# Altium project STM32F373BluePill.PrjPcb (part 2 of 4)
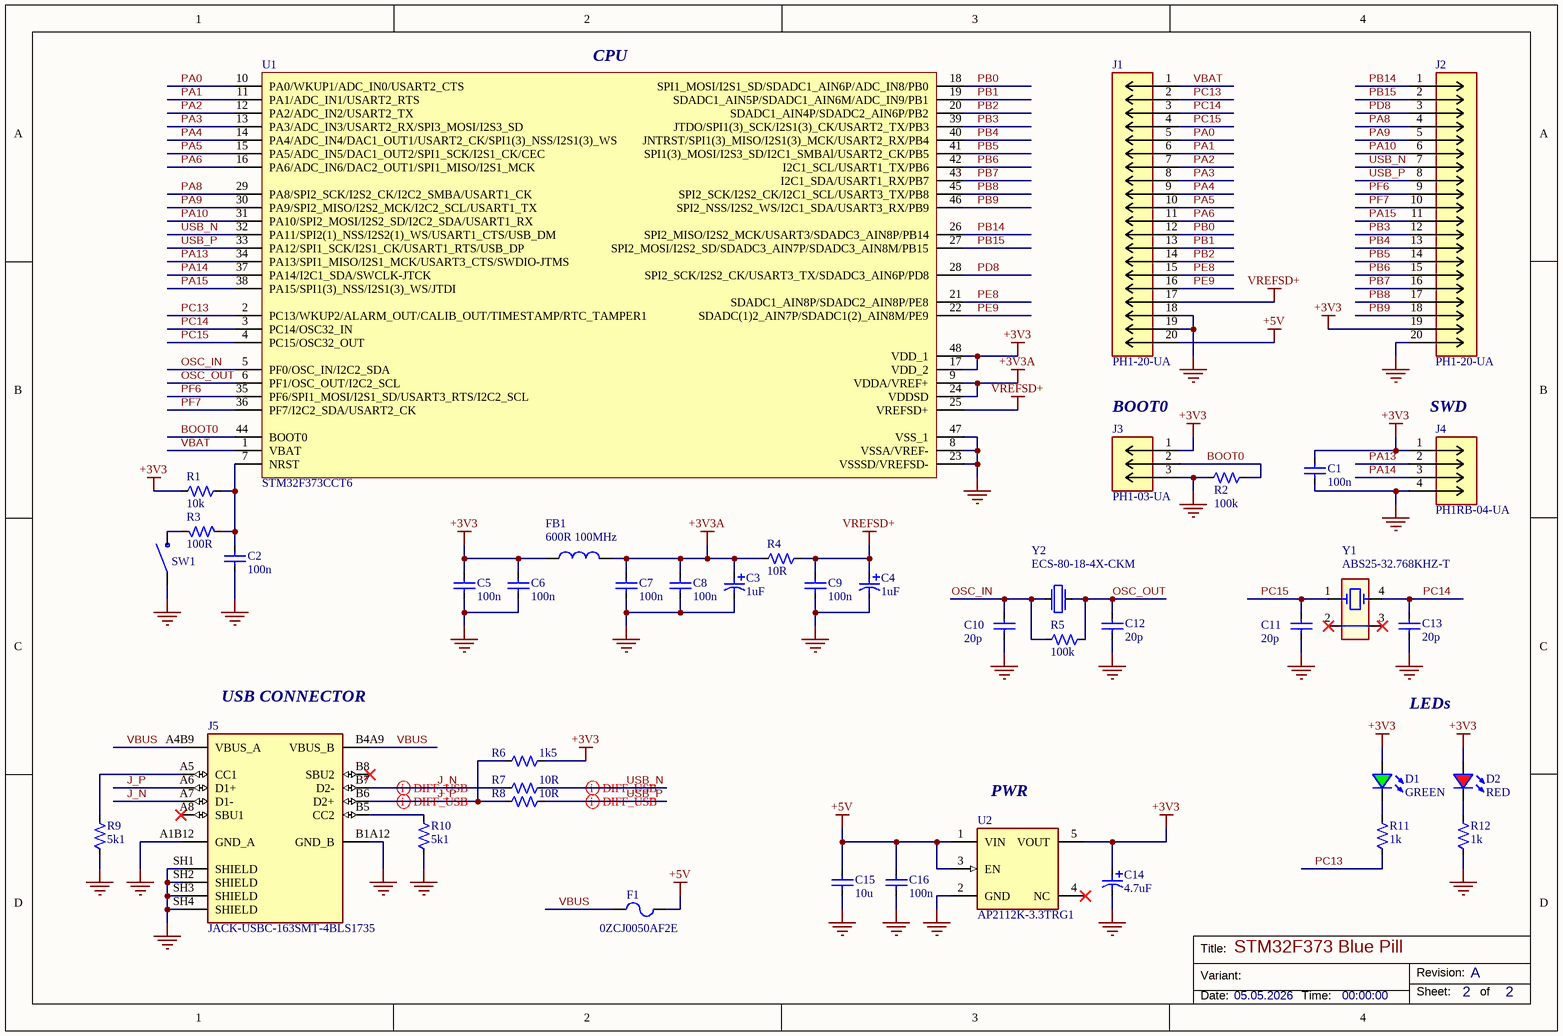
[diagram p2: [02]-STM32F373BluePill.SchDoc]

## Sheet [02]-STM32F373BluePill.SchDoc (continued)
### Library data of the parts
C1 C2 C5-C9 C16 = CAPC_GCM188R71H104KA57J: 0.1 µF ±10% 50V Ceramic Capacitor X7R 0603 (1608 Metric); Manufacturer 1: Murata; Manufacturer Lifecycle Status: NRND; Capacitance: 100nF; Tolerance: 10%; Case/Package: 0603; Supplier 1: DigiKey; Manufacturer Part Number 1: GCM188R71H104KA57J; Stock 1: 7240958; Pricing 1: 1=0.19, 10=0.109, 50=0.0774, 100=0.0678, 500=0.05152, 1000=0.0465, 2500=0.04122, 5000=0.03804 (USD); RoHS: Compliant; Case Code (Imperial): 0603; Case Code (Metric): 1608; Country of Origin: Philippines; Depth: 800µm; Dielectric: X7R; Dielectric Material: Ceramic; Export Control Classification Number (ECCN) Code: EAR99; Height: 800µm; Harmonized Tariff Schedule (HTS) Code: 8532.24.00.20; Introduction Date: 2007-06-21; Lead Free: Lead Free; Length: 1.6mm; Lifecycle Status: NRND; Material: Ceramic; Max Operating Temperature: 125°C; Min Operating Temperature: -55°C; Mount: Surface Mount; Number of Terminals: 2; Packaging: Cut Tape; Radiation Hardening: No; Ratings: AEC-Q200; REACH SVHC: Yes; Schedule B: 8532240020, 8532240020|8532240020, 8532240020|8532240020|8532240020, 8532240020|8532240020|8532240020|8532240020; Termination: SMD/SMT; Voltage Rating: 50V; Voltage Rating (DC): 50V; Width: 800µm; ComponentLink1URL: https://datasheet.octopart.com:443/GCM188R71H104KA57J-Murata-datasheet-68587539.pdf?src-supplier=Newark; ComponentLink1Description: https://datasheet.octopart.com:443/GCM188R71H104KA57J-Murata-datasheet-68587539.pdf?src-supplier=Newark; ComponentLink2URL: https://datasheet.octopart.com:443/GCM188R71H104KA57J-Murata-datasheet-141267633.pdf?src-supplier=Geoflip; ComponentLink2Description: https://datasheet.octopart.com:443/GCM188R71H104KA57J-Murata-datasheet-141267633.pdf?src-supplier=Geoflip; ComponentLink3URL: https://datasheet.octopart.com:443/GCM188R71H104KA57J-Murata-datasheet-140658746.pdf?src-supplier=Ciiva; ComponentLink3Description: https://datasheet.octopart.com:443/GCM188R71H104KA57J-Murata-datasheet-140658746.pdf?src-supplier=Ciiva; ComponentLink4URL: https://datasheet.octopart.com:443/GCM188R71H104KA57J-Murata-datasheet-138718311.pdf?src-supplier=Ciiva; ComponentLink4Description: https://datasheet.octopart.com:443/GCM188R71H104KA57J-Murata-datasheet-138718311.pdf?src-supplier=Ciiva; ComponentLink5URL: https://datasheet.octopart.com:443/GCM188R71H104KA57J-Murata-datasheet-62117434.pdf?src-supplier=TME; ComponentLink5Description: https://datasheet.octopart.com:443/GCM188R71H104KA57J-Murata-datasheet-62117434.pdf?src-supplier=TME; ComponentLink6URL: https://datasheet.octopart.com/GCM188R71H104KA57J-Murata-datasheet-12557478.pdf; ComponentLink6Description: https://datasheet.octopart.com/GCM188R71H104KA57J-Murata-datasheet-12557478.pdf; ComponentLink7URL: https://datasheet.octopart.com:443/GCM188R71H104KA57J-Murata-datasheet-44104515.pdf?src-supplier=Future+Electronics; ComponentLink7Description: https://datasheet.octopart.com:443/GCM188R71H104KA57J-Murata-datasheet-44104515.pdf?src-supplier=Future+Electronics; ComponentLink8URL: http://sigma.octopart.com:80/reach_statement/Murata-company-16.pdf?src-supplier=Compliance+Statements; ComponentLink8Description: http://sigma.octopart.com:80/reach_statement/Murata-company-16.pdf?src-supplier=Compliance+Statements; Supplier Part Number 1: 490-8020-1-ND
C3 C4 = CAP_T491A105K020AT: 1 µF Molded Tantalum Capacitors 20 V 1206 (3216 Metric) 9Ohm; Manufacturer 1: Yageo Group; Capacitance: 1µF; Dissipation Factor: 4%; ESR (Equivalent Series Resistance): 9Ω; Leakage Current: 500nA; Life (Hours): 2000hours; Polarity: Polar; Ripple Current: 36mA; Tolerance: 10%; Voltage: 20V; Supplier 1: DigiKey; Manufacturer Part Number 1: T491A105K020AT; Stock 1: 46509; Pricing 1: 1=0.37, 10=0.218, 50=0.1602, 100=0.1424, 500=0.11252, 1000=0.1033 (USD); RoHS: Compliant; Case Code (Imperial): 1206; Case Code (Metric): 3216; China RoHS: Compliant; Country of Origin: Mexico; Depth: 1.6mm; Dielectric Material: Tantalum; Export Control Classification Number (ECCN) Code: EAR99; Features: General Purpose; Height: 1.6mm; Height - Seated (Max): 1.8034mm; Harmonized Tariff Schedule (HTS) Code: 8532.21.00.50; Introduction Date: 2001-10-01; Lead Free: Lead Free; Lead Pitch: 1.2mm; Length: 3.2mm; Lifecycle Status: Production; Max Operating Temperature: 125°C; Min Operating Temperature: -55°C; Mount: Surface Mount; Number of Pins: 2; Number of Terminals: 2; Packaging: Cut Tape; Radiation Hardening: No; REACH SVHC: Yes; Schedule B: 8532210050, 8532210050|8532210050|8532210050|8532210050|8532210050; Termination: SMD/SMT; Voltage Rating: 20V; Voltage Rating (DC): 20V; Width: 1.6mm; ComponentLink1URL: https://datasheet.octopart.com:443/T491A105K020AT-KEMET-datasheet-182059868.pdf?src-supplier=IHS; ComponentLink1Description: https://datasheet.octopart.com:443/T491A105K020AT-KEMET-datasheet-182059868.pdf?src-supplier=IHS; ComponentLink2URL: https://datasheet.octopart.com:443/T491A105K020AT-KEMET-datasheet-136608597.pdf?src-supplier=Newark; ComponentLink2Description: https://datasheet.octopart.com:443/T491A105K020AT-KEMET-datasheet-136608597.pdf?src-supplier=Newark; ComponentLink3URL: https://datasheet.octopart.com:443/T491A105K020AT-KEMET-datasheet-84169765.pdf?src-supplier=Newark; ComponentLink3Description: https://datasheet.octopart.com:443/T491A105K020AT-KEMET-datasheet-84169765.pdf?src-supplier=Newark; ComponentLink4URL: https://datasheet.octopart.com:443/T491A105K020AT-Kemet-datasheet-26590412.pdf?src-supplier=Newark; ComponentLink4Description: https://datasheet.octopart.com:443/T491A105K020AT-Kemet-datasheet-26590412.pdf?src-supplier=Newark; ComponentLink5URL: https://datasheet.octopart.com:443/T491A105K020AT-Kemet-datasheet-21202602.pdf?src-supplier=Newark; ComponentLink5Description: https://datasheet.octopart.com:443/T491A105K020AT-Kemet-datasheet-21202602.pdf?src-supplier=Newark; ComponentLink6URL: https://datasheet.octopart.com:443/T491A105K020AT-KEMET-datasheet-181972716.pdf?src-supplier=Farnell; ComponentLink6Description: https://datasheet.octopart.com:443/T491A105K020AT-KEMET-datasheet-181972716.pdf?src-supplier=Farnell; ComponentLink7URL: https://datasheet.octopart.com:443/T491A105K020AT-KEMET-datasheet-101578314.pdf?src-supplier=Farnell; ComponentLink7Description: https://datasheet.octopart.com:443/T491A105K020AT-KEMET-datasheet-101578314.pdf?src-supplier=Farnell; ComponentLink8URL: https://datasheet.octopart.com:443/T491A105K020AT-Kemet-datasheet-32026213.pdf?src-supplier=Farnell; ComponentLink8Description: https://datasheet.octopart.com:443/T491A105K020AT-Kemet-datasheet-32026213.pdf?src-supplier=Farnell; ComponentLink9URL: https://datasheet.octopart.com:443/T491A105K020AT-KEMET-datasheet-176142724.pdf?src-supplier=Farnell; ComponentLink9Description: https://datasheet.octopart.com:443/T491A105K020AT-KEMET-datasheet-176142724.pdf?src-supplier=Farnell; ComponentLink10URL: https://datasheet.octopart.com:443/T491A105K020AT.-Kemet-datasheet-32543724.pdf?src-supplier=Farnell; ComponentLink10Description: https://datasheet.octopart.com:443/T491A105K020AT.-Kemet-datasheet-32543724.pdf?src-supplier=Farnell; ComponentLink11URL: https://datasheet.octopart.com:443/T491A105K020AT-Kemet-datasheet-10403912.pdf?src-supplier=Farnell; ComponentLink11Description: https://datasheet.octopart.com:443/T491A105K020AT-Kemet-datasheet-10403912.pdf?src-supplier=Farnell; ComponentLink12URL: https://datasheet.octopart.com:443/T491A105K020AT-Kemet-datasheet-7833651.pdf?src-supplier=Farnell; ComponentLink12Description: https://datasheet.octopart.com:443/T491A105K020AT-Kemet-datasheet-7833651.pdf?src-supplier=Farnell; ComponentLink13URL: https://datasheet.octopart.com:443/T491A105K020AT-Kemet-datasheet-7601896.pdf?src-supplier=Farnell; ComponentLink13Description: https://datasheet.octopart.com:443/T491A105K020AT-Kemet-datasheet-7601896.pdf?src-supplier=Farnell; ComponentLink14URL: https://datasheet.octopart.com:443/T491A105K020AT-Kemet-datasheet-5316294.pdf?src-supplier=Farnell; ComponentLink14Description: https://datasheet.octopart.com:443/T491A105K020AT-Kemet-datasheet-5316294.pdf?src-supplier=Farnell; ComponentLink15URL: https://datasheet.octopart.com:443/T491A105K020AT-Kemet-datasheet-8092359.pdf?src-supplier=Farnell; ComponentLink15Description: https://datasheet.octopart.com:443/T491A105K020AT-Kemet-datasheet-8092359.pdf?src-supplier=Farnell; ComponentLink16URL: https://datasheet.octopart.com:443/T491A105K020AT-Kemet-datasheet-5313890.pdf?src-supplier=Farnell; ComponentLink16Description: https://datasheet.octopart.com:443/T491A105K020AT-Kemet-datasheet-5313890.pdf?src-supplier=Farnell; ComponentLink17URL: https://datasheet.octopart.com:443/T491A105K020AT-Kemet-datasheet-5314449.pdf?src-supplier=Farnell; ComponentLink17Description: https://datasheet.octopart.com:443/T491A105K020AT-Kemet-datasheet-5314449.pdf?src-supplier=Farnell; ComponentLink18URL: https://datasheet.octopart.com:443/T491A105K020AT-Kemet-datasheet-5390537.pdf?src-supplier=Farnell; ComponentLink18Description: https://datasheet.octopart.com:443/T491A105K020AT-Kemet-datasheet-5390537.pdf?src-supplier=Farnell; ComponentLink19URL: https://datasheet.octopart.com:443/T491A105K020AT-Kemet-datasheet-5314969.pdf?src-supplier=Farnell; ComponentLink19Description: https://datasheet.octopart.com:443/T491A105K020AT-Kemet-datasheet-5314969.pdf?src-supplier=Farnell; ComponentLink20URL: https://datasheet.octopart.com:443/T491A105K020AT-Kemet-datasheet-5314627.pdf?src-supplier=Farnell; ComponentLink20Description: https://datasheet.octopart.com:443/T491A105K020AT-Kemet-datasheet-5314627.pdf?src-supplier=Farnell; ComponentLink21URL: https://datasheet.octopart.com:443/T491A105K020AT-Kemet-datasheet-5389132.pdf?src-supplier=Farnell; ComponentLink21Description: https://datasheet.octopart.com:443/T491A105K020AT-Kemet-datasheet-5389132.pdf?src-supplier=Farnell; ComponentLink22URL: https://datasheet.octopart.com:443/T491A105K020AT-Kemet-datasheet-5313836.pdf?src-supplier=Farnell; ComponentLink22Description: https://datasheet.octopart.com:443/T491A105K020AT-Kemet-datasheet-5313836.pdf?src-supplier=Farnell; ComponentLink23URL: https://datasheet.octopart.com:443/T491A105K020AT-Kemet-datasheet-8111010.pdf?src-supplier=Farnell; ComponentLink23Description: https://datasheet.octopart.com:443/T491A105K020AT-Kemet-datasheet-8111010.pdf?src-supplier=Farnell; ComponentLink24URL: https://datasheet.octopart.com:443/T491A105K020AT-Kemet-datasheet-7541751.pdf?src-supplier=Farnell; ComponentLink24Description: https://datasheet.octopart.com:443/T491A105K020AT-Kemet-datasheet-7541751.pdf?src-supplier=Farnell; ComponentLink25URL: https://datasheet.octopart.com:443/T491A105K020AT-Kemet-datasheet-7627733.pdf?src-supplier=Farnell; ComponentLink25Description: https://datasheet.octopart.com:443/T491A105K020AT-Kemet-datasheet-7627733.pdf?src-supplier=Farnell; ComponentLink26URL: https://datasheet.octopart.com:443/T491A105K020AT-Kemet-datasheet-5303455.pdf?src-supplier=Farnell; ComponentLink26Description: https://datasheet.octopart.com:443/T491A105K020AT-Kemet-datasheet-5303455.pdf?src-supplier=Farnell; ComponentLink27URL: https://datasheet.octopart.com:443/T491A105K020AT-Kemet-datasheet-5315946.pdf?src-supplier=Farnell; ComponentLink27Description: https://datasheet.octopart.com:443/T491A105K020AT-Kemet-datasheet-5315946.pdf?src-supplier=Farnell; ComponentLink28URL: https://datasheet.octopart.com:443/T491A105K020AT-Kemet-datasheet-10694886.pdf?src-supplier=Farnell; ComponentLink28Description: https://datasheet.octopart.com:443/T491A105K020AT-Kemet-datasheet-10694886.pdf?src-supplier=Farnell; ComponentLink29URL: https://datasheet.octopart.com:443/T491A105K020AT-KEMET-datasheet-38887703.pdf?src-supplier=Electro+Sonic; ComponentLink29Description: https://datasheet.octopart.com:443/T491A105K020AT-KEMET-datasheet-38887703.pdf?src-supplier=Electro+Sonic; ComponentLink30URL: https://datasheet.octopart.com:443/T491A105K020AT-Kemet-datasheet-10674785.pdf?src-supplier=element14; ComponentLink30Description: https://datasheet.octopart.com:443/T491A105K020AT-Kemet-datasheet-10674785.pdf?src-supplier=element14; ComponentLink31URL: https://datasheet.octopart.com:443/T491A105K020AT-Kemet-datasheet-9885770.pdf?src-supplier=element14; ComponentLink31Description: https://datasheet.octopart.com:443/T491A105K020AT-Kemet-datasheet-9885770.pdf?src-supplier=element14; ComponentLink32URL: https://datasheet.octopart.com:443/T491A105K020AT-Kemet-datasheet-8859524.pdf?src-supplier=element14; ComponentLink32Description: https://datasheet.octopart.com:443/T491A105K020AT-Kemet-datasheet-8859524.pdf?src-supplier=element14; ComponentLink33URL: https://datasheet.octopart.com:443/T491A105K020AT-Kemet-datasheet-5314837.pdf?src-supplier=element14; ComponentLink33Description: https://datasheet.octopart.com:443/T491A105K020AT-Kemet-datasheet-5314837.pdf?src-supplier=element14; ComponentLink34URL: https://datasheet.octopart.com:443/T491A105K020AT-Kemet-datasheet-8838294.pdf?src-supplier=element14; ComponentLink34Description: https://datasheet.octopart.com:443/T491A105K020AT-Kemet-datasheet-8838294.pdf?src-supplier=element14; ComponentLink35URL: https://datasheet.octopart.com:443/T491A105K020AT-Kemet-datasheet-11547191.pdf?src-supplier=_legacy+Avnet; ComponentLink35Description: https://datasheet.octopart.com:443/T491A105K020AT-Kemet-datasheet-11547191.pdf?src-supplier=_legacy+Avnet; ComponentLink36URL: https://datasheet.octopart.com:443/T491A105K020AT-KEMET-datasheet-142660448.pdf?src-supplier=TME; ComponentLink36Description: https://datasheet.octopart.com:443/T491A105K020AT-KEMET-datasheet-142660448.pdf?src-supplier=TME; ComponentLink37URL: https://datasheet.octopart.com:443/T491A105K020AT-Kemet-datasheet-67498737.pdf?src-supplier=TME; ComponentLink37Description: https://datasheet.octopart.com:443/T491A105K020AT-Kemet-datasheet-67498737.pdf?src-supplier=TME; ComponentLink38URL: https://datasheet.octopart.com:443/T491A105K020AT-KEMET-datasheet-117635134.pdf?src-supplier=TME; ComponentLink38Description: https://datasheet.octopart.com:443/T491A105K020AT-KEMET-datasheet-117635134.pdf?src-supplier=TME; ComponentLink39URL: https://datasheet.octopart.com:443/T491A105K020AT-Kemet-datasheet-62346238.pdf?src-supplier=TME; ComponentLink39Description: https://datasheet.octopart.com:443/T491A105K020AT-Kemet-datasheet-62346238.pdf?src-supplier=TME; ComponentLink40URL: https://datasheet.octopart.com:443/T491A105K020AT-Kemet-datasheet-49872651.pdf?src-supplier=TME; ComponentLink40Description: https://datasheet.octopart.com:443/T491A105K020AT-Kemet-datasheet-49872651.pdf?src-supplier=TME; ComponentLink41URL: https://datasheet.octopart.com:443/T491A105K020AT-Kemet-datasheet-21389585.pdf?src-supplier=element14+APAC; ComponentLink41Description: https://datasheet.octopart.com:443/T491A105K020AT-Kemet-datasheet-21389585.pdf?src-supplier=element14+APAC; ComponentLink42URL: https://datasheet.octopart.com:443/T491A105K020AT-Kemet-datasheet-15068589.pdf?src-supplier=element14+APAC; ComponentLink42Description: https://datasheet.octopart.com:443/T491A105K020AT-Kemet-datasheet-15068589.pdf?src-supplier=element14+APAC; ComponentLink43URL: https://datasheet.octopart.com:443/T491A105K020AT-Kemet-datasheet-13378218.pdf?src-supplier=element14+APAC; ComponentLink43Description: https://datasheet.octopart.com:443/T491A105K020AT-Kemet-datasheet-13378218.pdf?src-supplier=element14+APAC; ComponentLink44URL: https://datasheet.octopart.com:443/T491A105K020AT-Kemet-datasheet-8189449.pdf?src-supplier=Jameco; ComponentLink44Description: https://datasheet.octopart.com:443/T491A105K020AT-Kemet-datasheet-8189449.pdf?src-supplier=Jameco; ComponentLink45URL: https://datasheet.octopart.com:443/T491A105K020AT-Kemet-datasheet-15.pdf?src-supplier=RS+(Formerly+Allied+Electronics); ComponentLink45Description: https://datasheet.octopart.com:443/T491A105K020AT-Kemet-datasheet-15.pdf?src-supplier=RS+(Formerly+Allied+Electronics); Supplier Part Number 1: 399-3679-1-ND; Case/Package: 1206
C10-C13 = CAPC_GCM1885C2A200JA16D: 20pF 100V C0G ±5% 0603 Multilayer Ceramic Capacitors MLCC - SMD/SMT ROHS; Manufacturer 1: Murata; Manufacturer Lifecycle Status: IN PRODUCTION; Temperature Coefficient: 30ppm/°C; Supplier 1: DigiKey; Manufacturer Part Number 1: GCM1885C2A200JA16D; Stock 1: 4877; Pricing 1: 1=0.1, 10=0.04, 50=0.0272, 100=0.0233, 500=0.01676, 1000=0.01475 (USD); RoHS: Compliant; Capacitance: 20pF; Case/Package: 0603; Case Code (Imperial): 0603; Case Code (Metric): 1608; Depth: 800µm; Dielectric: C0G; Dielectric Material: Ceramic; Height: 800µm; Length: 1.6mm; Lifecycle Status: Production; Material: Ceramic; Max Operating Temperature: 125°C; Min Operating Temperature: -55°C; Mount: Surface Mount; Number of Terminals: 2; Packaging: Tape & Reel; Radiation Hardening: No; Ratings: AEC-Q200; REACH SVHC: Yes; Schedule B: 8532240020, 8532240020|8532240020, 8532240020|8532240020|8532240020, 8532240020|8532240020|8532240020|8532240020; Termination: SMD/SMT; Tolerance: 5%; Voltage Rating: 100V; Voltage Rating (DC): 100V; Width: 800µm; ComponentLink1URL: https://datasheet.octopart.com:443/GCM1885C2A200JA16D-Murata-datasheet-149522631.pdf?src-supplier=Newark; ComponentLink1Description: https://datasheet.octopart.com:443/GCM1885C2A200JA16D-Murata-datasheet-149522631.pdf?src-supplier=Newark; ComponentLink2URL: https://datasheet.octopart.com:443/GCM1885C2A200JA16D-Murata-datasheet-141266620.pdf?src-supplier=Geoflip; ComponentLink2Description: https://datasheet.octopart.com:443/GCM1885C2A200JA16D-Murata-datasheet-141266620.pdf?src-supplier=Geoflip; ComponentLink3URL: https://datasheet.octopart.com:443/GCM1885C2A200JA16D-Murata-datasheet-140657476.pdf?src-supplier=Ciiva; ComponentLink3Description: https://datasheet.octopart.com:443/GCM1885C2A200JA16D-Murata-datasheet-140657476.pdf?src-supplier=Ciiva; ComponentLink4URL: https://datasheet.octopart.com:443/GCM1885C2A200JA16D-Murata-datasheet-138717120.pdf?src-supplier=Ciiva; ComponentLink4Description: https://datasheet.octopart.com:443/GCM1885C2A200JA16D-Murata-datasheet-138717120.pdf?src-supplier=Ciiva; ComponentLink5URL: https://datasheet.octopart.com:443/GCM1885C2A200JA16D-Murata-datasheet-118179445.pdf?src-supplier=Future+Electronics; ComponentLink5Description: https://datasheet.octopart.com:443/GCM1885C2A200JA16D-Murata-datasheet-118179445.pdf?src-supplier=Future+Electronics; ComponentLink6URL: https://datasheet.octopart.com:443/GCM1885C2A200JA16D-Murata-datasheet-11745854.pdf?src-supplier=Arrow+Electronics; ComponentLink6Description: https://datasheet.octopart.com:443/GCM1885C2A200JA16D-Murata-datasheet-11745854.pdf?src-supplier=Arrow+Electronics; ComponentLink7URL: https://datasheet.octopart.com:443/GCM1885C2A200JA16D-Murata-datasheet-12511495.pdf?src-supplier=TME; ComponentLink7Description: https://datasheet.octopart.com:443/GCM1885C2A200JA16D-Murata-datasheet-12511495.pdf?src-supplier=TME; ComponentLink8URL: https://datasheet.octopart.com/GCM1885C2A200JA16D-Murata-datasheet-14404810.pdf; ComponentLink8Description: https://datasheet.octopart.com/GCM1885C2A200JA16D-Murata-datasheet-14404810.pdf; ComponentLink9URL: http://sigma.octopart.com:80/reach_statement/Murata-company-16.pdf?src-supplier=Compliance+Statements; ComponentLink9Description: http://sigma.octopart.com:80/reach_statement/Murata-company-16.pdf?src-supplier=Compliance+Statements; Supplier Part Number 1: 490-11157-1-ND; Export Control Classification Number (ECCN) Code: EAR99; Harmonized Tariff Schedule (HTS) Code: 8532.24.00.20; Introduction Date: 2008-10-18
C14 = CAP_T491A475K025AT: 4.7 µF Molded Tantalum Capacitors 25 V 1206 (3216 Metric) 6Ohm; Manufacturer 1: Yageo Group; Capacitance: 4.7µF; Dissipation Factor: 8%; ESR (Equivalent Series Resistance): 6Ω; Leakage Current: 1.2µA; Life (Hours): 2000hours; Polarity: Polar; Ripple Current: 44.8mA; Tolerance: 10%; Voltage Rating: 25V; Supplier 1: DigiKey; Manufacturer Part Number 1: T491A475K025AT; Stock 1: 97298; Pricing 1: 1=0.46, 10=0.276, 50=0.2056, 100=0.1839, 500=0.14724, 1000=0.13591 (USD); RoHS: Compliant; Case/Package: 1206; Case Code (Imperial): 1206; Case Code (Metric): 3216; China RoHS: Compliant; Country of Origin: Mexico; Depth: 1.6mm; Dielectric Material: Tantalum; Export Control Classification Number (ECCN) Code: EAR99; Features: General Purpose; Height: 1.6mm; Height - Seated (Max): 1.8034mm; Harmonized Tariff Schedule (HTS) Code: 8532.21.00.50; Introduction Date: 2007-10-05; Lead Free: Lead Free; Length: 3.2mm; Lifecycle Status: Production; Max Operating Temperature: 125°C; Min Operating Temperature: -55°C; Mount: Surface Mount; Number of Pins: 2; Number of Terminals: 2; Radiation Hardening: No; REACH SVHC: Yes; Schedule B: 8532210050, 8532210050|8532210050|8532210050|8532210050|8532210050; Terminal Pitch: 800µm; Termination: SMD/SMT; Voltage Rating (DC): 25V; Weight: 16.187578mg; Width: 1.6mm; ComponentLink1URL: https://datasheet.octopart.com:443/T491A475K025AT-KEMET-datasheet-182059868.pdf?src-supplier=IHS; ComponentLink1Description: https://datasheet.octopart.com:443/T491A475K025AT-KEMET-datasheet-182059868.pdf?src-supplier=IHS; ComponentLink2URL: https://datasheet.octopart.com:443/T491A475K025AT-KEMET-datasheet-84169765.pdf?src-supplier=element14+APAC; ComponentLink2Description: https://datasheet.octopart.com:443/T491A475K025AT-KEMET-datasheet-84169765.pdf?src-supplier=element14+APAC; ComponentLink3URL: https://datasheet.octopart.com:443/T491A475K025AT-Kemet-datasheet-15068589.pdf?src-supplier=element14+APAC; ComponentLink3Description: https://datasheet.octopart.com:443/T491A475K025AT-Kemet-datasheet-15068589.pdf?src-supplier=element14+APAC; ComponentLink4URL: https://datasheet.octopart.com:443/T491A475K025AT-Kemet-datasheet-66535510.pdf?src-supplier=element14+APAC; ComponentLink4Description: https://datasheet.octopart.com:443/T491A475K025AT-Kemet-datasheet-66535510.pdf?src-supplier=element14+APAC; ComponentLink5URL: https://datasheet.octopart.com:443/T491A475K025AT-Kemet-datasheet-32543724.pdf?src-supplier=element14+APAC; ComponentLink5Description: https://datasheet.octopart.com:443/T491A475K025AT-Kemet-datasheet-32543724.pdf?src-supplier=element14+APAC; ComponentLink6URL: https://datasheet.octopart.com:443/T491A475K025AT-Kemet-datasheet-32026213.pdf?src-supplier=element14+APAC; ComponentLink6Description: https://datasheet.octopart.com:443/T491A475K025AT-Kemet-datasheet-32026213.pdf?src-supplier=element14+APAC; ComponentLink7URL: https://datasheet.octopart.com:443/T491A475K025AT-KEMET-datasheet-136608597.pdf?src-supplier=Newark; ComponentLink7Description: https://datasheet.octopart.com:443/T491A475K025AT-KEMET-datasheet-136608597.pdf?src-supplier=Newark; ComponentLink8URL: https://datasheet.octopart.com:443/T491A475K025AT-KEMET-datasheet-176142744.pdf?src-supplier=Newark; ComponentLink8Description: https://datasheet.octopart.com:443/T491A475K025AT-KEMET-datasheet-176142744.pdf?src-supplier=Newark; ComponentLink9URL: https://datasheet.octopart.com:443/T491A475K025AT-Kemet-datasheet-21202602.pdf?src-supplier=Newark; ComponentLink9Description: https://datasheet.octopart.com:443/T491A475K025AT-Kemet-datasheet-21202602.pdf?src-supplier=Newark; ComponentLink10URL: https://datasheet.octopart.com:443/T491A475K025AT-KEMET-datasheet-181972791.pdf?src-supplier=Farnell; ComponentLink10Description: https://datasheet.octopart.com:443/T491A475K025AT-KEMET-datasheet-181972791.pdf?src-supplier=Farnell; ComponentLink11URL: https://datasheet.octopart.com:443/T491A475K025AT-KEMET-datasheet-101578389.pdf?src-supplier=Farnell; ComponentLink11Description: https://datasheet.octopart.com:443/T491A475K025AT-KEMET-datasheet-101578389.pdf?src-supplier=Farnell; ComponentLink12URL: https://datasheet.octopart.com:443/T491A475K025AT-Kemet-datasheet-13378218.pdf?src-supplier=Farnell; ComponentLink12Description: https://datasheet.octopart.com:443/T491A475K025AT-Kemet-datasheet-13378218.pdf?src-supplier=Farnell; ComponentLink13URL: https://datasheet.octopart.com:443/T491A475K025AT-Kemet-datasheet-14421347.pdf?src-supplier=Farnell; ComponentLink13Description: https://datasheet.octopart.com:443/T491A475K025AT-Kemet-datasheet-14421347.pdf?src-supplier=Farnell; ComponentLink14URL: https://datasheet.octopart.com:443/T491A475K025AT-Kemet-datasheet-10694886.pdf?src-supplier=Farnell; ComponentLink14Description: https://datasheet.octopart.com:443/T491A475K025AT-Kemet-datasheet-10694886.pdf?src-supplier=Farnell; ComponentLink15URL: https://datasheet.octopart.com:443/T491A475K025AT-KEMET-datasheet-142660448.pdf?src-supplier=TME; ComponentLink15Description: https://datasheet.octopart.com:443/T491A475K025AT-KEMET-datasheet-142660448.pdf?src-supplier=TME; ComponentLink16URL: https://datasheet.octopart.com:443/T491A475K025AT-Kemet-datasheet-67498774.pdf?src-supplier=TME; ComponentLink16Description: https://datasheet.octopart.com:443/T491A475K025AT-Kemet-datasheet-67498774.pdf?src-supplier=TME; ComponentLink17URL: https://datasheet.octopart.com:443/T491A475K025AT-KEMET-datasheet-117635134.pdf?src-supplier=TME; ComponentLink17Description: https://datasheet.octopart.com:443/T491A475K025AT-KEMET-datasheet-117635134.pdf?src-supplier=TME; ComponentLink18URL: https://datasheet.octopart.com:443/T491A475K025AT-Kemet-datasheet-62346238.pdf?src-supplier=TME; ComponentLink18Description: https://datasheet.octopart.com:443/T491A475K025AT-Kemet-datasheet-62346238.pdf?src-supplier=TME; ComponentLink19URL: https://datasheet.octopart.com:443/T491A475K025AT-Kemet-datasheet-49872651.pdf?src-supplier=TME; ComponentLink19Description: https://datasheet.octopart.com:443/T491A475K025AT-Kemet-datasheet-49872651.pdf?src-supplier=TME; ComponentLink20URL: https://datasheet.octopart.com:443/T491A475K025AT-KEMET-datasheet-164857296.pdf?src-supplier=Burklin+Elektronik; ComponentLink20Description: https://datasheet.octopart.com:443/T491A475K025AT-KEMET-datasheet-164857296.pdf?src-supplier=Burklin+Elektronik; ComponentLink21URL: https://datasheet.octopart.com:443/T491A475K025AT-Kemet-datasheet-11547191.pdf?src-supplier=Arrow+Electronics; ComponentLink21Description: https://datasheet.octopart.com:443/T491A475K025AT-Kemet-datasheet-11547191.pdf?src-supplier=Arrow+Electronics; Supplier Part Number 1: 399-10128-1-ND
C15 = CAPC_GRM188C81C106MA73D: 10 µF ±20% 16V Ceramic Capacitor X6S 0603 (1608 Metric); Manufacturer 1: Murata; Manufacturer Lifecycle Status: IN PRODUCTION; Capacitance: 10µF; Tolerance: 20%; Voltage: 16V; Case/Package: 0603; Manufacturer Part Number 1: GRM188C81C106MA73D; Supplier 1: DigiKey; Stock 1: 589738; Pricing 1: 4000=0.05174, 8000=0.04833, 12000=0.04662, 20000=0.04472, 28000=0.04362, 40000=0.04255 (USD); RoHS: Compliant; Case Code (Imperial): 0603; Case Code (Metric): 1608; Composition: Ceramic; Country of Origin: Philippines; Depth: 800µm; Dielectric: X6S; Dielectric Material: Ceramic; Export Control Classification Number (ECCN) Code: EAR99; Height: 800µm; Harmonized Tariff Schedule (HTS) Code: 8532.24.00.20; Introduction Date: 2013-01-29; Lead Free: Lead Free; Length: 1.6mm; Lifecycle Status: Production; Material: Ceramic; Max Operating Temperature: 105°C; Min Operating Temperature: -55°C; Mount: Surface Mount; Number of Terminals: 2; REACH SVHC: Yes; Schedule B: 8532240020, 8532240020|8532240020|8532240020|8532240020|8532240020|8532240020|8532240020|8532240020|8532240020|8532240020|8532240020|8532240020, 8532240020|8532240020|8532240020|8532240020|8532240020|8532240020|8532240020|8532240020|8532240020|8532240020|8532240020|8532240020|8532240020, 8532240020|8532240020|8532240020|8532240020|8532240020|8532240020|8532240020|8532240020|8532240020|8532240020|8532240020|8532240020|8532240020|8532240020; Termination: SMD/SMT; Thickness: 800µm; Voltage Rating: 16V; Voltage Rating (DC): 16V; Weight: 6.293594mg; Width: 800µm; ComponentLink1URL: https://datasheet.octopart.com:443/GRM188C81C106MA73D-Murata-datasheet-39128502.pdf?src-supplier=Newark; ComponentLink1Description: https://datasheet.octopart.com:443/GRM188C81C106MA73D-Murata-datasheet-39128502.pdf?src-supplier=Newark; ComponentLink2URL: https://datasheet.octopart.com:443/GRM188C81C106MA73D-Murata-datasheet-62317175.pdf?src-supplier=element14+APAC; ComponentLink2Description: https://datasheet.octopart.com:443/GRM188C81C106MA73D-Murata-datasheet-62317175.pdf?src-supplier=element14+APAC; ComponentLink3URL: https://datasheet.octopart.com:443/GRM188C81C106MA73D-Murata-datasheet-141274680.pdf?src-supplier=Geoflip; ComponentLink3Description: https://datasheet.octopart.com:443/GRM188C81C106MA73D-Murata-datasheet-141274680.pdf?src-supplier=Geoflip; ComponentLink4URL: https://datasheet.octopart.com:443/GRM188C81C106MA73D-Murata-datasheet-14397259.pdf?src-supplier=Future+Electronics; ComponentLink4Description: https://datasheet.octopart.com:443/GRM188C81C106MA73D-Murata-datasheet-14397259.pdf?src-supplier=Future+Electronics; ComponentLink5URL: https://datasheet.octopart.com:443/GRM188C81C106MA73D-Murata-datasheet-22122223.pdf?src-supplier=Future+Electronics; ComponentLink5Description: https://datasheet.octopart.com:443/GRM188C81C106MA73D-Murata-datasheet-22122223.pdf?src-supplier=Future+Electronics; ComponentLink6URL: https://datasheet.octopart.com:443/GRM188C81C106MA73D-Murata-datasheet-44107402.pdf?src-supplier=Future+Electronics; ComponentLink6Description: https://datasheet.octopart.com:443/GRM188C81C106MA73D-Murata-datasheet-44107402.pdf?src-supplier=Future+Electronics; ComponentLink7URL: https://datasheet.octopart.com:443/GRM188C81C106MA73D-Murata-datasheet-165579666.pdf?src-supplier=TME; ComponentLink7Description: https://datasheet.octopart.com:443/GRM188C81C106MA73D-Murata-datasheet-165579666.pdf?src-supplier=TME; ComponentLink8URL: https://datasheet.octopart.com:443/GRM188C81C106MA73D-Murata-datasheet-140703336.pdf?src-supplier=Ciiva; ComponentLink8Description: https://datasheet.octopart.com:443/GRM188C81C106MA73D-Murata-datasheet-140703336.pdf?src-supplier=Ciiva; ComponentLink9URL: https://datasheet.octopart.com:443/GRM188C81C106MA73D-Murata-datasheet-138742672.pdf?src-supplier=Ciiva; ComponentLink9Description: https://datasheet.octopart.com:443/GRM188C81C106MA73D-Murata-datasheet-138742672.pdf?src-supplier=Ciiva; ComponentLink10URL: https://datasheet.octopart.com/GRM188C81C106MA73D-Murata-datasheet-12515295.pdf; ComponentLink10Description: https://datasheet.octopart.com/GRM188C81C106MA73D-Murata-datasheet-12515295.pdf; ComponentLink11URL: https://datasheet.octopart.com/GRM188C81C106MA73D-Murata-datasheet-12510076.pdf; ComponentLink11Description: https://datasheet.octopart.com/GRM188C81C106MA73D-Murata-datasheet-12510076.pdf; ComponentLink12URL: https://datasheet.octopart.com/GRM188C81C106MA73D-Murata-datasheet-11978611.pdf; ComponentLink12Description: https://datasheet.octopart.com/GRM188C81C106MA73D-Murata-datasheet-11978611.pdf; ComponentLink13URL: https://datasheet.octopart.com/GRM188C81C106MA73D-Murata-datasheet-10025737.pdf; ComponentLink13Description: https://datasheet.octopart.com/GRM188C81C106MA73D-Murata-datasheet-10025737.pdf; ComponentLink14URL: https://datasheet.octopart.com/GRM188C81C106MA73D-Murata-datasheet-8819587.pdf; ComponentLink14Description: https://datasheet.octopart.com/GRM188C81C106MA73D-Murata-datasheet-8819587.pdf; ComponentLink15URL: http://sigma.octopart.com:80/reach_statement/Murata-company-16.pdf?src-supplier=Compliance+Statements; ComponentLink15Description: http://sigma.octopart.com:80/reach_statement/Murata-company-16.pdf?src-supplier=Compliance+Statements; Supplier Part Number 1: 490-7198-2-ND
D1 = LED_150060VS75003: Led, Bright Green, 100Mcd, 572Nm Rohs Compliant: Yes; Manufacturer 1: Wurth Elektronik; Dominant Wavelength: 567nm; Forward Current: 100mA; Forward Voltage: 2V; Max Reverse Voltage (DC): 5V; Viewing Angle: 140°; Supplier 1: DigiKey; Manufacturer Part Number 1: 150060VS75003; Stock 1: 1618; Pricing 1: 1=0,35, 50=0,283, 100=0,249, 250=0,226, 1000=0,19278 (USD); RoHS: Compliant; Height: 700µm; Length: 1.6mm; Luminous Intensity: 100mcd; Max Operating Temperature: 100°C; Min Operating Temperature: -40°C; Peak Wavelength: 572nm; Width: 800µm; ComponentLink1URL: https://datasheet.octopart.com:443/150060VS75003-Wurth-Elektronik-datasheet-168473758.pdf?src-supplier=Farnell; ComponentLink1Description: https://datasheet.octopart.com:443/150060VS75003-Wurth-Elektronik-datasheet-168473758.pdf?src-supplier=Farnell; Supplier Part Number 1: 732-150060VS75003CT-ND; Case/Package: 0603
D2 = LED_150060RS75003: LED RED CLEAR 0603 SMD; Manufacturer 1: Wurth Elektronik; Dominant Wavelength: 615nm; Forward Current: 100mA; Forward Voltage: 2V; Luminous Intensity: 530mcd; Max Junction Temperature (Tj): 125°C; Max Reverse Voltage (DC): 5V; Peak Wavelength: 630nm; Power Dissipation: 78mW; Viewing Angle: 140°; Wavelength: 625nm; Supplier 1: DigiKey; Manufacturer Part Number 1: 150060RS75003; Stock 1: 49005; Pricing 1: 1=0,35, 50=0,283, 100=0,249, 250=0,226, 1000=0,19278 (USD); RoHS: Compliant; Case/Package: 0603; Color: Red; Height: 800µm; Max Operating Temperature: 100°C; Min Operating Temperature: -40°C; Reverse Voltage: 5V; ComponentLink1URL: https://datasheet.octopart.com:443/150060RS75003-Wurth-Elektronik-datasheet-170333962.pdf?src-supplier=Farnell; ComponentLink1Description: https://datasheet.octopart.com:443/150060RS75003-Wurth-Elektronik-datasheet-170333962.pdf?src-supplier=Farnell; Supplier Part Number 1: 732-150060RS75003CT-ND
F1 = 0ZCJ0050AF2E: Resettable Fuse, PPTC, 1206 (3216 Metric), 0ZCJ Series, 24 VDC, 500 mA, 1 A, 0.1 s; Manufacturer 1: Bel Fuse; Approvals: TUV, UL; Current Rating: 100A; Hold Current: 500mA; Maximum Resistance 1 Hour (R1max): 750mΩ; Max Voltage Rating (DC): 24V; Power Dissipation: 600mW; Resistance: 150mΩ; Time to Trip: 100ms; Trip Current: 1A; Supplier 1: DigiKey; Manufacturer Part Number 1: 0ZCJ0050AF2E; Stock 1: 130033; Pricing 1: 1=0,28, 5=0,234, 10=0,215, 50=0,1786, 100=0,1649, 250=0,14824, 500=0,13676, 1000=0,12615 (USD); RoHS: Compliant; Case/Package: 1206; Case Code (Imperial): 1206; Case Code (Metric): 3216; China RoHS: Compliant; Contact Plating: Tin; Height: 1.2mm; Lead Free: Lead Free; Lifecycle Status: Production; Max Current Rating: 100A; Max Operating Temperature: 85°C; Min Operating Temperature: -40°C; Mount: Surface Mount; Number of Terminals: 2; Packaging: Tape & Reel (TR); REACH SVHC: Yes; Schedule B: 8533290000|8533290000|8533290000|8533290000|8533290000|8533290000|8533290000|8533290000|8533290000|8533290000|8533290000|8533290000|8533290000|8533290000|8533290000|8533290000|8533290000|8533290000|8533290000|8533290000|8533290000|8533290000|8533290000|85; Voltage Rating: 24V; Width: 1.8mm; Working Voltage: 24V; ComponentLink1URL: https://datasheet.octopart.com:443/0ZCJ0050AF2E-Bel-Fuse-datasheet-182141362.pdf?src-supplier=IHS; ComponentLink1Description: https://datasheet.octopart.com:443/0ZCJ0050AF2E-Bel-Fuse-datasheet-182141362.pdf?src-supplier=IHS; ComponentLink2URL: https://datasheet.octopart.com:443/0ZCJ0050AF2E-Bel-Fuse-datasheet-137696978.pdf?src-supplier=Electro+Sonic; ComponentLink2Description: https://datasheet.octopart.com:443/0ZCJ0050AF2E-Bel-Fuse-datasheet-137696978.pdf?src-supplier=Electro+Sonic; ComponentLink3URL: https://datasheet.octopart.com:443/0ZCJ0050AF2E-Bel-Fuse-datasheet-179230428.pdf?src-supplier=Electro+Sonic; ComponentLink3Description: https://datasheet.octopart.com:443/0ZCJ0050AF2E-Bel-Fuse-datasheet-179230428.pdf?src-supplier=Electro+Sonic; ComponentLink4URL: https://datasheet.octopart.com:443/0ZCJ0050AF2E-Bel-Fuse-datasheet-102831406.pdf?src-supplier=Sager+Electronics; ComponentLink4Description: https://datasheet.octopart.com:443/0ZCJ0050AF2E-Bel-Fuse-datasheet-102831406.pdf?src-supplier=Sager+Electronics; ComponentLink5URL: https://datasheet.octopart.com/0ZCJ0050AF2E-Bel-Fuse-datasheet-66464704.pdf; ComponentLink5Description: https://datasheet.octopart.com/0ZCJ0050AF2E-Bel-Fuse-datasheet-66464704.pdf; Supplier Part Number 1: 5923-0ZCJ0050AF2ECT-ND
FB1 = BLM18AG601SN1D: 600 Ohms @ 100 MHz 1 Ferrite Bead 0603 (1608 Metric) 500mA 380mOhm; Manufacturer 1: Murata; DC Resistance (DCR): 380mΩ; Impedance: 600Ω; Material: Ferrite, Steel; Number of Circuits: 1; Shielding: Unshielded; Tolerance: 25%; Supplier 1: DigiKey; Manufacturer Part Number 1: BLM18AG601SN1D; Stock 1: 747463; Pricing 1: 1=0.1, 10=0.056, 25=0.0488, 50=0.0438, 100=0.0393, 250=0.03388, 500=0.03016, 1000=0.02672 (USD); RoHS: Compliant; Case/Package: 0603; Case Code (Imperial): 0603; Case Code (Metric): 1608; Core Material: Ferrite; Country of Origin: Japan, Thailand; Current Rating: 500mA; DC Current: 500mA; Depth: 800µm; Export Control Classification Number (ECCN) Code: EAR99; Frequency: 100MHz; Height: 800µm; Harmonized Tariff Schedule (HTS) Code: 8504.50.80.00; Introduction Date: 2001-08-28; Lead Free: Lead Free; Length: 1.6mm; Lifecycle Status: Production; Max Current Rating: 500mA; Max DC Current: 500mA; Max Frequency: 100MHz; Max Operating Temperature: 125°C; Military Standard: Not; Min Operating Temperature: -55°C; Number of Lines: 1; Number of Pins: 2; Number of Terminals: 2; Packaging: Cut Tape; Radiation Hardening: No; REACH SVHC: Yes; Resistance: 380mΩ; RMS Current (Irms): 500mA; Schedule B: 8543706000, 8543706000|8543706000, 8543706000|8543706000|8543706000, 8543706000|8543706000|8543706000|8543706000; Series Resistance: 380mΩ; Termination: SMD/SMT; Test Frequency: 100MHz; Weight: 2.012816mg; Width: 800µm; ComponentLink1URL: https://datasheet.octopart.com:443/BLM18AG601SN1D-Murata-datasheet-180806579.pdf?src-supplier=IHS; ComponentLink1Description: https://datasheet.octopart.com:443/BLM18AG601SN1D-Murata-datasheet-180806579.pdf?src-supplier=IHS; ComponentLink2URL: https://datasheet.octopart.com:443/BLM18AG601SN1D-Murata-datasheet-41195.pdf?src-supplier=Upverter; ComponentLink2Description: https://datasheet.octopart.com:443/BLM18AG601SN1D-Murata-datasheet-41195.pdf?src-supplier=Upverter; ComponentLink3URL: https://datasheet.octopart.com:443/BLM18AG601SN1D-Murata-datasheet-11743096.pdf?src-supplier=Newark; ComponentLink3Description: https://datasheet.octopart.com:443/BLM18AG601SN1D-Murata-datasheet-11743096.pdf?src-supplier=Newark; ComponentLink4URL: https://datasheet.octopart.com:443/BLM18AG601SN1D-Murata-datasheet-5338592.pdf?src-supplier=Newark; ComponentLink4Description: https://datasheet.octopart.com:443/BLM18AG601SN1D-Murata-datasheet-5338592.pdf?src-supplier=Newark; ComponentLink5URL: https://datasheet.octopart.com:443/BLM18AG601SN1D-Murata-datasheet-511221.pdf?src-supplier=TME; ComponentLink5Description: https://datasheet.octopart.com:443/BLM18AG601SN1D-Murata-datasheet-511221.pdf?src-supplier=TME; ComponentLink6URL: https://datasheet.octopart.com:443/BLM18AG601SN1D-Murata-datasheet-135086656.pdf?src-supplier=TME; ComponentLink6Description: https://datasheet.octopart.com:443/BLM18AG601SN1D-Murata-datasheet-135086656.pdf?src-supplier=TME; ComponentLink7URL: https://datasheet.octopart.com:443/BLM18AG601SN1D-Murata-datasheet-5396529.pdf?src-supplier=Factory+Futures; ComponentLink7Description: https://datasheet.octopart.com:443/BLM18AG601SN1D-Murata-datasheet-5396529.pdf?src-supplier=Factory+Futures; ComponentLink8URL: https://datasheet.octopart.com:443/BLM18AG601SN1D-Murata-datasheet-141257898.pdf?src-supplier=Ciiva; ComponentLink8Description: https://datasheet.octopart.com:443/BLM18AG601SN1D-Murata-datasheet-141257898.pdf?src-supplier=Ciiva; ComponentLink9URL: https://datasheet.octopart.com:443/BLM18AG601SN1D-Murata-datasheet-138706784.pdf?src-supplier=Ciiva; ComponentLink9Description: https://datasheet.octopart.com:443/BLM18AG601SN1D-Murata-datasheet-138706784.pdf?src-supplier=Ciiva; ComponentLink10URL: https://datasheet.octopart.com:443/BLM18AG601SN1D-Murata-datasheet-78375072.pdf?src-supplier=Future+Electronics; ComponentLink10Description: https://datasheet.octopart.com:443/BLM18AG601SN1D-Murata-datasheet-78375072.pdf?src-supplier=Future+Electronics; ComponentLink11URL: https://datasheet.octopart.com:443/BLM18AG601SN1D-Murata-datasheet-58177255.pdf?src-supplier=Future+Electronics; ComponentLink11Description: https://datasheet.octopart.com:443/BLM18AG601SN1D-Murata-datasheet-58177255.pdf?src-supplier=Future+Electronics; ComponentLink12URL: https://datasheet.octopart.com/BLM18AG601SN1D-Murata-datasheet-37129980.pdf; ComponentLink12Description: https://datasheet.octopart.com/BLM18AG601SN1D-Murata-datasheet-37129980.pdf; ComponentLink13URL: https://datasheet.octopart.com:443/BLM18AG601SN1D-Murata-datasheet-14066397.pdf?src-supplier=iiiC; ComponentLink13Description: https://datasheet.octopart.com:443/BLM18AG601SN1D-Murata-datasheet-14066397.pdf?src-supplier=iiiC; ComponentLink14URL: https://datasheet.octopart.com:443/BLM18AG601SN1D-Murata-datasheet-9604654.pdf?src-supplier=RS+(Formerly+Allied+Electronics); ComponentLink14Description: https://datasheet.octopart.com:443/BLM18AG601SN1D-Murata-datasheet-9604654.pdf?src-supplier=RS+(Formerly+Allied+Electronics); ComponentLink15URL: https://datasheet.octopart.com:443/BLM18AG601SN1D-Murata-datasheet-13143.pdf?src-supplier=RS+(Formerly+Allied+Electronics); ComponentLink15Description: https://datasheet.octopart.com:443/BLM18AG601SN1D-Murata-datasheet-13143.pdf?src-supplier=RS+(Formerly+Allied+Electronics); ComponentLink16URL: https://datasheet.octopart.com:443/BLM18AG601SN1D-Murata-datasheet-7628479.pdf?src-supplier=Jameco; ComponentLink16Description: https://datasheet.octopart.com:443/BLM18AG601SN1D-Murata-datasheet-7628479.pdf?src-supplier=Jameco; ComponentLink17URL: https://datasheet.octopart.com:443/BLM18AG601SN1D-Murata-datasheet-11030792.pdf?src-supplier=Farnell; ComponentLink17Description: https://datasheet.octopart.com:443/BLM18AG601SN1D-Murata-datasheet-11030792.pdf?src-supplier=Farnell; ComponentLink18URL: http://sigma.octopart.com:80/reach_statement/Murata-company-16.pdf?src-supplier=Compliance+Statements; ComponentLink18Description: http://sigma.octopart.com:80/reach_statement/Murata-company-16.pdf?src-supplier=Compliance+Statements; Supplier Part Number 1: 490-1014-1-ND
J1 J2 = CON_PH1-20-UA: Conn Unshrouded Header HDR 10 POS 2.54mm Solder RA Side Entry Thru-Hole Bag; Manufacturer 1: Adam Tech; Contact Resistance: 20mΩ; Current Rating: 3A; Insulation Resistance: 5GΩ; Number of Positions: 20; Supplier 1: DigiKey; Manufacturer Part Number 1: PH1-20-UA; Stock 1: 10514; Pricing 1: 1=0.26, 10=0.217, 100=0.1846, 500=0.16474, 1000=0.15687, 5000=0.14002, 10000=0.13333 (USD); RoHS: Compliant; Contact Gender: Male; Contact Material: Brass; Lead Free: Lead Free; Lifecycle Status: Production; Number of Pins: 20; Number of Rows: 1; Pitch: 2.54mm; REACH SVHC: Yes; Terminal Pitch: 2.54mm; Termination: PCB; ComponentLink1URL: https://datasheet.octopart.com:443/PH1-20-UA-Adam-Tech-datasheet-21182886.pdf?src-supplier=IHS; ComponentLink1Description: https://datasheet.octopart.com:443/PH1-20-UA-Adam-Tech-datasheet-21182886.pdf?src-supplier=IHS; ComponentLink2URL: https://datasheet.octopart.com:443/PH1-20-UA-Adam-Tech-datasheet-12510360.pdf?src-supplier=Future+Electronics; ComponentLink2Description: https://datasheet.octopart.com:443/PH1-20-UA-Adam-Tech-datasheet-12510360.pdf?src-supplier=Future+Electronics; ComponentLink3URL: https://datasheet.octopart.com:443/PH1-20-UA-Adam-Tech-datasheet-502038.pdf?src-supplier=Future+Electronics; ComponentLink3Description: https://datasheet.octopart.com:443/PH1-20-UA-Adam-Tech-datasheet-502038.pdf?src-supplier=Future+Electronics; ComponentLink4URL: https://datasheet.octopart.com:443/PH1-20-UA-Adam-Tech-datasheet-189096092.pdf?src-supplier=Master+Electronics; ComponentLink4Description: https://datasheet.octopart.com:443/PH1-20-UA-Adam-Tech-datasheet-189096092.pdf?src-supplier=Master+Electronics; ComponentLink5URL: http://sigma.octopart.com:80/reach_statement/Adam-Tech-company-23.pdf?src-supplier=Compliance+Statements; ComponentLink5Description: http://sigma.octopart.com:80/reach_statement/Adam-Tech-company-23.pdf?src-supplier=Compliance+Statements; ComponentLink6URL: http://sigma.octopart.com:80/rohs_statement/Adam-Tech-company-22.pdf?src-supplier=Compliance+Statements; ComponentLink6Description: http://sigma.octopart.com:80/rohs_statement/Adam-Tech-company-22.pdf?src-supplier=Compliance+Statements; Supplier Part Number 1: 2057-PH1-20-UA-ND
J3 = CON_PH1-03-UA: Conn Unshrouded Header HDR 3 POS 2.54mm Solder ST Top Entry Thru-Hole Bag; Manufacturer 1: Adam Tech; Contact Resistance: 20mΩ; Current Rating: 3A; Insulation Resistance: 5GΩ; Number of Positions: 3; Supplier 1: DigiKey; Manufacturer Part Number 1: PH1-03-UA; Stock 1: 32987; Pricing 1: 1=0.1, 10=0.047, 100=0.0401, 500=0.0358, 1000=0.03408, 5000=0.03041, 10000=0.02896 (USD); RoHS: Compliant; Contact Gender: Male; Contact Material: Brass; Export Control Classification Number (ECCN) Code: EAR99; Harmonized Tariff Schedule (HTS) Code: 8536.69.40.40; Introduction Date: 2004-11-19; Lead Free: Lead Free; Lifecycle Status: Production; Number of Pins: 3; Number of Rows: 1; Pitch: 2.54mm; REACH SVHC: Yes; Schedule B: 8536694040, 8536694040|8536694040, 8536694040|8536694040|8536694040, 8536694040|8536694040|8536694040|8536694040; Terminal Pitch: 2.54mm; ComponentLink1URL: https://datasheet.octopart.com:443/PH1-03-UA-Adam-Tech-datasheet-21182886.pdf?src-supplier=IHS; ComponentLink1Description: https://datasheet.octopart.com:443/PH1-03-UA-Adam-Tech-datasheet-21182886.pdf?src-supplier=IHS; ComponentLink2URL: https://datasheet.octopart.com:443/PH1-03-UA-Adam-Tech-datasheet-8326657.pdf?src-supplier=Future+Electronics; ComponentLink2Description: https://datasheet.octopart.com:443/PH1-03-UA-Adam-Tech-datasheet-8326657.pdf?src-supplier=Future+Electronics; ComponentLink3URL: https://datasheet.octopart.com:443/PH1-03-UA-Adam-Tech-datasheet-502038.pdf?src-supplier=Future+Electronics; ComponentLink3Description: https://datasheet.octopart.com:443/PH1-03-UA-Adam-Tech-datasheet-502038.pdf?src-supplier=Future+Electronics; ComponentLink4URL: https://datasheet.octopart.com:443/PH1-03-UA-Adam-Tech-datasheet-189096092.pdf?src-supplier=Master+Electronics; ComponentLink4Description: https://datasheet.octopart.com:443/PH1-03-UA-Adam-Tech-datasheet-189096092.pdf?src-supplier=Master+Electronics; ComponentLink5URL: http://sigma.octopart.com:80/reach_statement/Adam-Tech-company-23.pdf?src-supplier=Compliance+Statements; ComponentLink5Description: http://sigma.octopart.com:80/reach_statement/Adam-Tech-company-23.pdf?src-supplier=Compliance+Statements; ComponentLink6URL: http://sigma.octopart.com:80/rohs_statement/Adam-Tech-company-22.pdf?src-supplier=Compliance+Statements; ComponentLink6Description: http://sigma.octopart.com:80/rohs_statement/Adam-Tech-company-22.pdf?src-supplier=Compliance+Statements; Supplier Part Number 1: 2057-PH1-03-UA-ND
J4 = CON_PH1RB-04-UA: PH1RB ROHS3Compliant COMMERCIAL UL CSA Connector Header 20mOhm -40C~105C 3A 250VAC; Manufacturer 1: Adam Tech; Contact Resistance: 20mΩ; Insulation Resistance: 5GΩ; Number of Contacts: 4; Supplier 1: DigiKey; Manufacturer Part Number 1: PH1RB-04-UA; Stock 1: 12985; Pricing 1: 1=0.16, 10=0.136, 100=0.1159, 500=0.10346, 1000=0.09852, 5000=0.08793, 10000=0.08373 (USD); RoHS: Compliant; Contact Gender: Male; Contact Material: Brass; Current Rating: 3A; Export Control Classification Number (ECCN) Code: EAR99; Height: 2.8702mm; Harmonized Tariff Schedule (HTS) Code: 8536.69.40.40; Introduction Date: 2012-01-13; Lifecycle Status: Production; Max Operating Temperature: 105°C; Min Operating Temperature: -40°C; Number of Pins: 4; Number of Rows: 1; REACH SVHC: Yes; Terminal Pitch: 2.54mm; ComponentLink1URL: https://datasheet.octopart.com:443/PH1RB-04-UA-Adam-Tech-datasheet-21182891.pdf?src-supplier=IHS; ComponentLink1Description: https://datasheet.octopart.com:443/PH1RB-04-UA-Adam-Tech-datasheet-21182891.pdf?src-supplier=IHS; ComponentLink2URL: http://sigma.octopart.com:80/reach_statement/Adam-Tech-company-23.pdf?src-supplier=Compliance+Statements; ComponentLink2Description: http://sigma.octopart.com:80/reach_statement/Adam-Tech-company-23.pdf?src-supplier=Compliance+Statements; ComponentLink3URL: http://sigma.octopart.com:80/rohs_statement/Adam-Tech-company-22.pdf?src-supplier=Compliance+Statements; ComponentLink3Description: http://sigma.octopart.com:80/rohs_statement/Adam-Tech-company-22.pdf?src-supplier=Compliance+Statements; Supplier Part Number 1: 2057-PH1RB-04-UA-ND
J5 = JACK-USBC-163SMT-4BLS1735: Usb Type C Jack IPX7 SMT; Manufacturer 1: GlobTek; Supplier 1: DigiKey; Manufacturer Part Number 1: JACK-USBC-163SMT-4BLS1735; Stock 1: 4264; Pricing 1: 1=0,76, 10=0,646, 25=0,6056, 50=0,5766, 100=0,5489, 250=0,51452, 500=0,48992, 1000=0,46653, 3000=0,43173 (USD); Supplier Part Number 1: 1939-JACK-USBC-163SMT-4BLS1735-ND